# EAGLE design drv8801 (EAGLE 5.06)
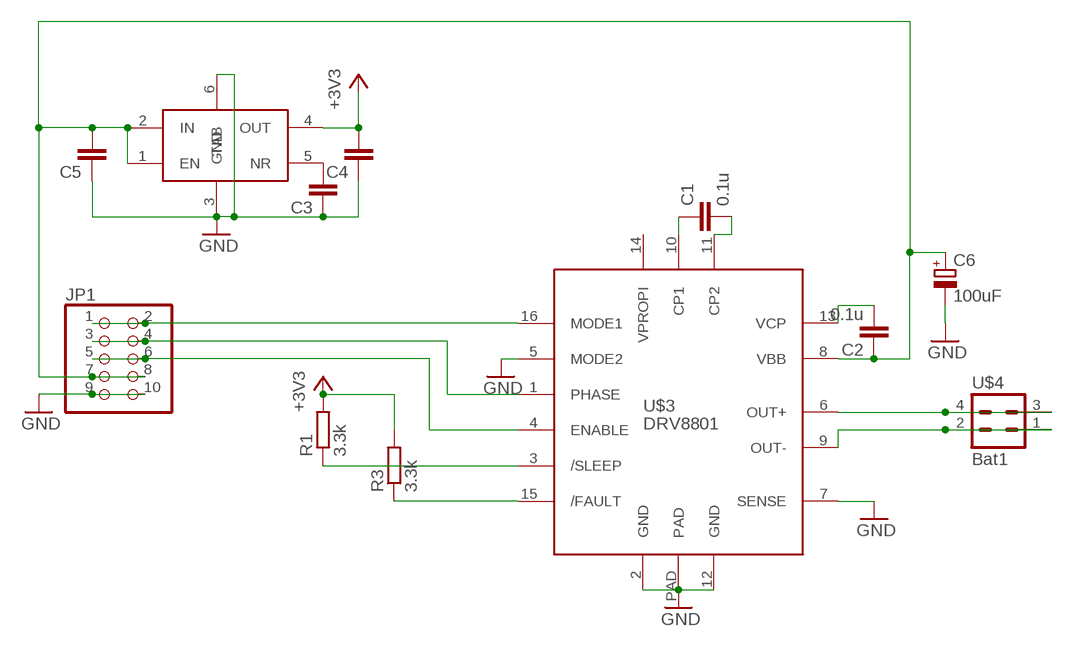
[diagram p0: schematic, sheet 1]

## Parts
C1  0.1u  C-EUC0805K  [C0805K]
C2  0.1u  C-EUC0805K  [C0805K]
C3  C-EUC0805K  [C0805K]
C4  C-EUC0805K  [C0805K]
C5  C-EUC0805K  [C0805K]
C6  100uF  CPOL-EU153CLV-0810  [153CLV-0810]
JP1  PINHD-2X5  [2X05]
R1  3.3k  R-EU_R0805  [R0805]
R3  3.3k  R-EU_R0805  [R0805]
U$1  TPS79633  [SOT-233-6]
U$3  DRV8801  [QFN16]
U$4  Bat1  CON_2X2  [HEADER_2X2]

## Nets
+3V3: C4.2 U$1.4(OUT)
/FAULT@1,1: R3.1 U$3.15(/FAULT)
/SLEEP@1,1: R1.1 U$3.3(/SLEEP)
ENABLE@4: JP1.5 JP1.6 U$3.4(ENABLE)
GND: C3.1 C4.1 C5.1 C6.- JP1.9 JP1.10 U$1.3(GND) U$1.6(TAB) U$3.2(GND) U$3.5(MODE2) U$3.7(SENSE) U$3.12(GND) U$3.PAD
N$1: C1.1 U$3.10(CP1)
N$2: C1.2 U$3.11(CP2)
N$3: JP1.1 JP1.2 U$3.16(MODE1)
N$5: U$3.6(OUT+) U$4.3 U$4.4
N$6: U$3.9(OUT-) U$4.1 U$4.2
N$7: C3.2 U$1.5(NR)
PHASE@4: JP1.3 JP1.4 U$3.1(PHASE)
VBB1: C2.1 C5.2 C6.+ JP1.7 JP1.8 U$1.1(EN) U$1.2(IN) U$3.8(VBB)
VCP@3: C2.2 U$3.13(VCP)
VDD: R1.2 R3.2 ; supply symbol labelled +3V3
Unconnected: U$3.14(VPROPI)

## Library data of the parts
C1-C5 = rcl:C-EU: CAPACITOR, European symbol
C6 = rcl:CPOL-EU: POLARIZED CAPACITOR, European symbol
JP1 = pinhead:PINHD-2X5: PIN HEADER
R1 R3 = rcl:R-EU_: RESISTOR, European symbol
U$1 = slom:TPS79633
U$3 = igeek:DRV8801: TI DRV8801 DMOS FULL-BRIDGE MOTOR DRIVER
U$4 = igeek:CON_2X2: Relimate 2x2 connector

## Board
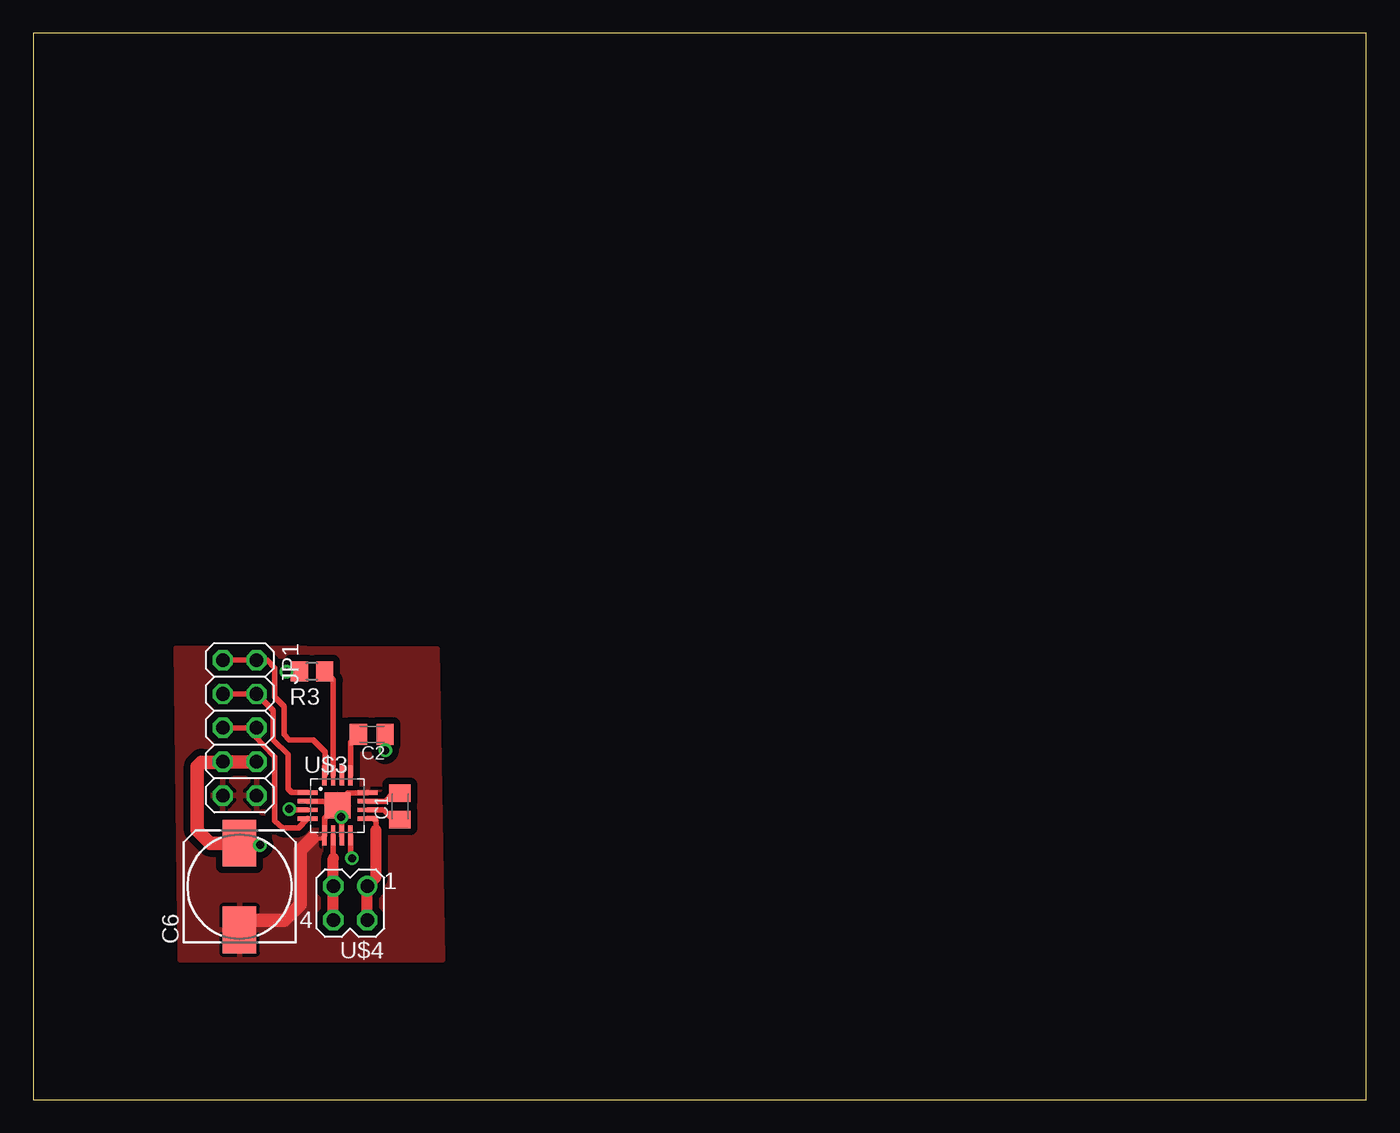
[diagram p1: board, top side]
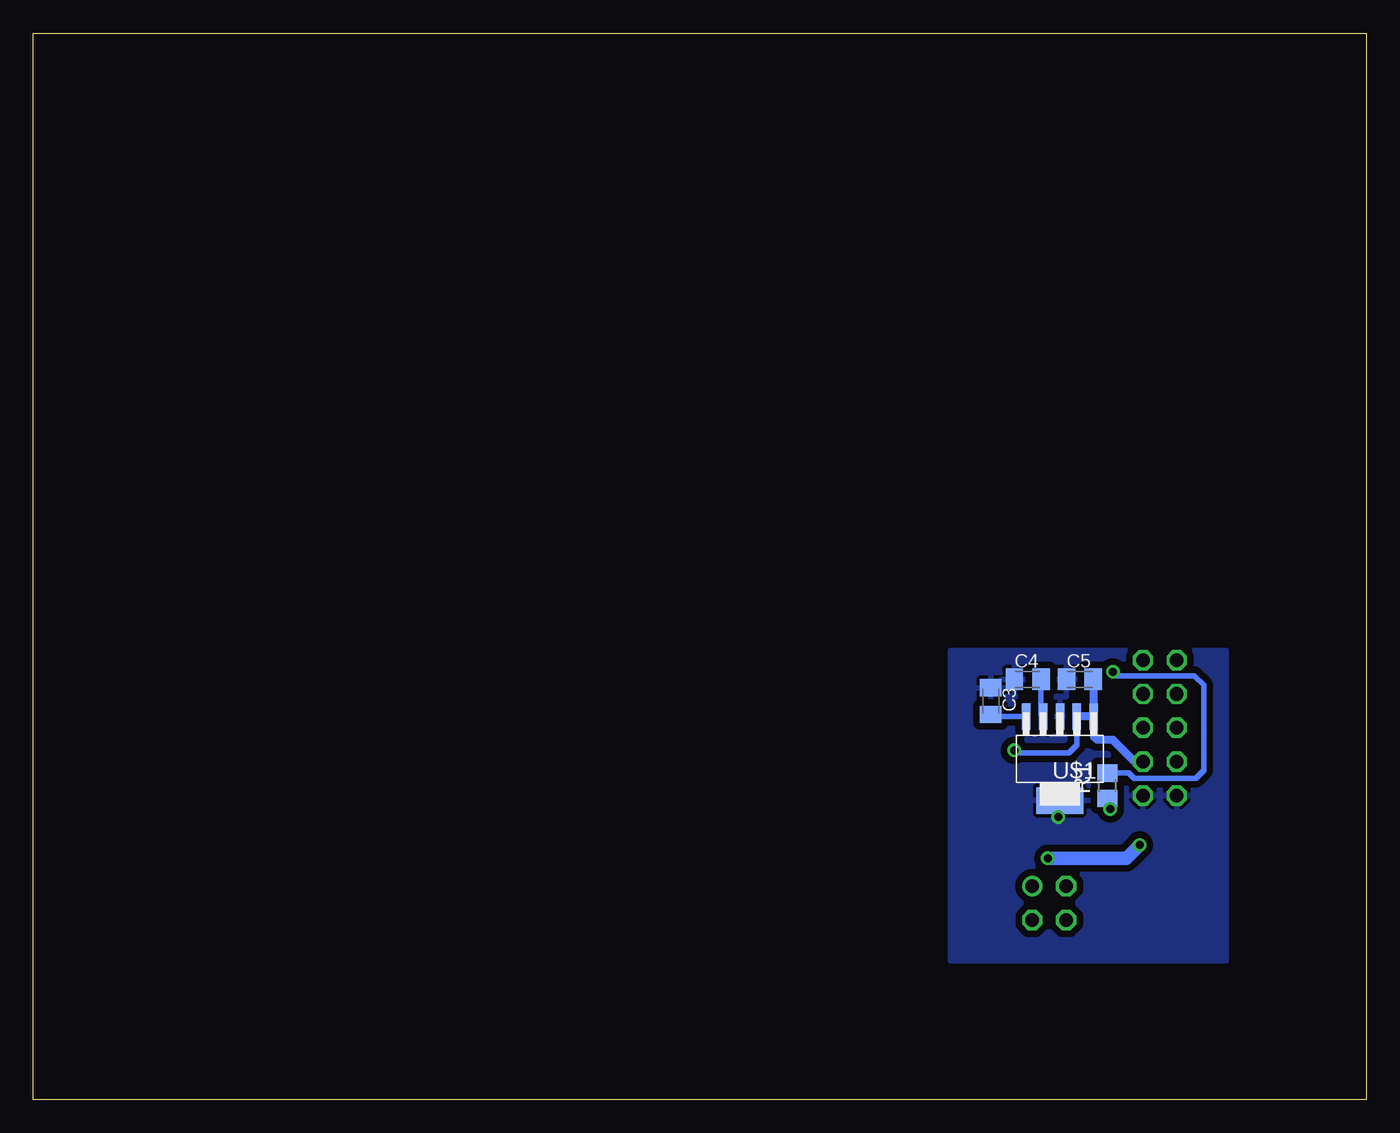
[diagram p2: board, bottom side, seen from below]

Size 100 x 80 mm. Coordinates in mm from the lower left corner, seen from the top.
Outline: 0,0 100,0 100,80 0,80 0,0
Copper layers (1*16): Top 0.035mm / dielectric 1.5mm / Bottom 0.035mm
Design rules "yashna": minimum track width 5mil, minimum drill 0.4mm, track to track 5mil, track to pad 5mil, pad to pad 5mil, via to via 5mil, smd to smd 0mil, copper to edge 40mil, drill to drill 0.4mm, minimum pad ring 10mil, minimum via ring 8mil, stop-mask expansion 4mil, vias tented up to drill 0mil, thermal gap 10mil

### Footprints (pad centres in the part's own frame; a part is rotated, then mirrored left to right if it is on the bottom)
C0805K = smd 1.3 x 1.6: 1 -1,0; 2 1,0
153CLV-0810 = smd 3.5 x 2.5: + 3.25,0; - -3.25,0
2X05 = drill 1.016 octagon: 1 -5.08,-1.27; 2 -5.08,1.27; 3 -2.54,-1.27; 4 -2.54,1.27; 5 0,-1.27; 6 0,1.27; 7 2.54,-1.27; 8 2.54,1.27; 9 5.08,-1.27; 10 5.08,1.27
R0805 = smd 1.3 x 1.5: 1 -0.95,0; 2 0.95,0
SOT-233-6 = smd 0.635 x 2: 1 -2.54,-3.175; 2 -1.27,-3.175; 3 0,-3.175; 4 1.27,-3.175; 5 2.54,-3.175 | smd 3.5 x 2: 6 0,3.125
QFN16 = smd 1.5 x 0.325: 1 -2.25,0.975; 2 -2.25,0.325; 3 -2.25,-0.325; 4 -2.25,-0.975; 9 2.25,-0.975; 10 2.25,-0.325; 11 2.25,0.325; 12 2.25,0.975 | smd 0.325 x 1.5: 5 -0.975,-2.25; 6 -0.325,-2.25; 7 0.325,-2.25; 8 0.975,-2.25; 13 0.975,2.25; 14 0.325,2.25; 15 -0.325,2.25; 16 -0.975,2.25 | smd 1.95 x 1.95: PAD 0,0
HEADER_2X2 = drill 1.016 round: 1 -1.27,-1.27 | drill 1.016 octagon: 2 -1.27,1.27; 3 1.27,-1.27; 4 1.27,1.27

### Placement (x,y rotation side)
C1  27.5,21.99 90 top
C2  25.39,27.4 180 top
C3  28.17,29.9 270 bottom
C4  25.39,31.53 0 bottom
C5  21.48,31.53 0 bottom
C6  15.47,15.98 90 top
JP1  15.48,27.89 270 top
R1  19.42,23.55 90 bottom
R3  20.9,32.12 180 top
U$1  22.98,25.56 180 bottom
U$3  22.82,22.06 0 top
U$4  23.78,14.74 180 top

### Tracks (layer width: path | path; a pad name or v marks a point on that pad's centre or on a via)
+3V3
  Bottom 0.406: C4.2 24.39,28.88 U$1.4
/FAULT@1,1
  Top 0.406: U$3.15 22.5,31.48 R3.1
/SLEEP@1,1  (via drill 0.6)
  Top 0.406: U$3.3 19.27,21.73 v19.2,21.8
  Bottom 0.406: v19.2,21.8 19.4,22.58 R1.1
ENABLE@4
  Top 0.406: JP1.5 JP1.6 16.6,27.74 16.6,27.3 18.1,25.7 18.1,20.9 18.7,20.4 19.9,20.4 20.2,20.7 20.2,20.71 U$3.4
GND  (via drill 0.6)
  Top 0.305: 20.9,19.6 21.64,19.6 U$3.5
  Top 0.406: U$3.7 23.14,21.73 U$3.PAD | U$3.5 21.84,21.09 U$3.PAD | U$3.12 25.04,23 23.6,23 22.82,22.22 U$3.PAD | U$3.PAD 22.82,21.12 v23.1,21.2 | U$3.2 22.5,22.39 U$3.PAD | C6.- 15.47,13.44
  Top 1.016: 15.47,13.44 18.84,13.44 20,14.6 20,18.7 20.9,19.6
  Bottom 0.406: v23.1,21.2 22.8,22.25 U$1.6
  pour Top (isolate 0.5): 10.7,33.9 30.3,33.8 30.7,10.5 11,10.5
  pour Bottom (isolate 0.5): 10.5,33.7 31.2,33.7 31.2,10.4 10.5,10.4
N$1
  Top 0.406: U$3.10 26.27,21.73 27,21 C1.1
N$2
  Top 0.406: U$3.11 26.39,22.39 27,23 C1.2
N$3
  Top 0.406: JP1.1 JP1.2 17.53,32.97 18.1,32.4 18.1,30.2 18.8,29.5 18.8,27.4 19.2,27 21,27 21.9,26.1 21.9,24.36 U$3.16
N$5
  Top 0.406: 22.5,18.1 U$3.6
  Top 0.813: U$4.4 U$4.3 22.51,18.09 22.5,18.1
N$6
  Top 0.406: U$3.9 25.52,21.09 25.7,20.9 25.7,20.2
  Top 0.813: 25.7,20.2 25.7,16.66 U$4.1 U$4.2
N$7
  Bottom 0.406: U$1.5 28,28.73 C3.2
PHASE@4
  Top 0.406: JP1.3 JP1.4 18,29.18 18,27 19.1,25.9 19.1,23.3 19.36,23.04 U$3.1
VBB1  (via drill 0.6)
  Top 0.406: U$3.8 23.8,18.2 v23.9,18.1 | v26.4,26.2 C2.1
  Top 1.016: JP1.8 JP1.7 14.16,25.3 12.6,25.3 12.3,25 12.3,20.2 13.27,19.23 C6.+ 15.6,19.1 v17,19.1
  Bottom 0.406: U$1.2 21.71,26.59 22.3,26 26.2,26 v26.4,26.2
  Bottom 0.61: JP1.8 17.35,25.35 19,27 20.2,27 20.4,27.2 20.4,28.7 U$1.1 | U$1.1 20.44,31.49 C5.2 | U$1.1 U$1.2
  Bottom 1.016: v23.9,18.1 18,18.1 v17,19.1
VCP@3
  Top 0.406: U$3.13 23.8,26.8 C2.2
VDD  (via drill 0.6)
  Top 0.406: v19,32.1 19.93,32.1 R3.2
  Bottom 0.406: R1.2 17.8,24.5 17.4,24.1 12.8,24.1 12.2,24.7 12.2,31.1 12.9,31.8 18.7,31.8 v19,32.1